# Altium schematic sheet STM32F4 - AMS.SchDoc
size A4
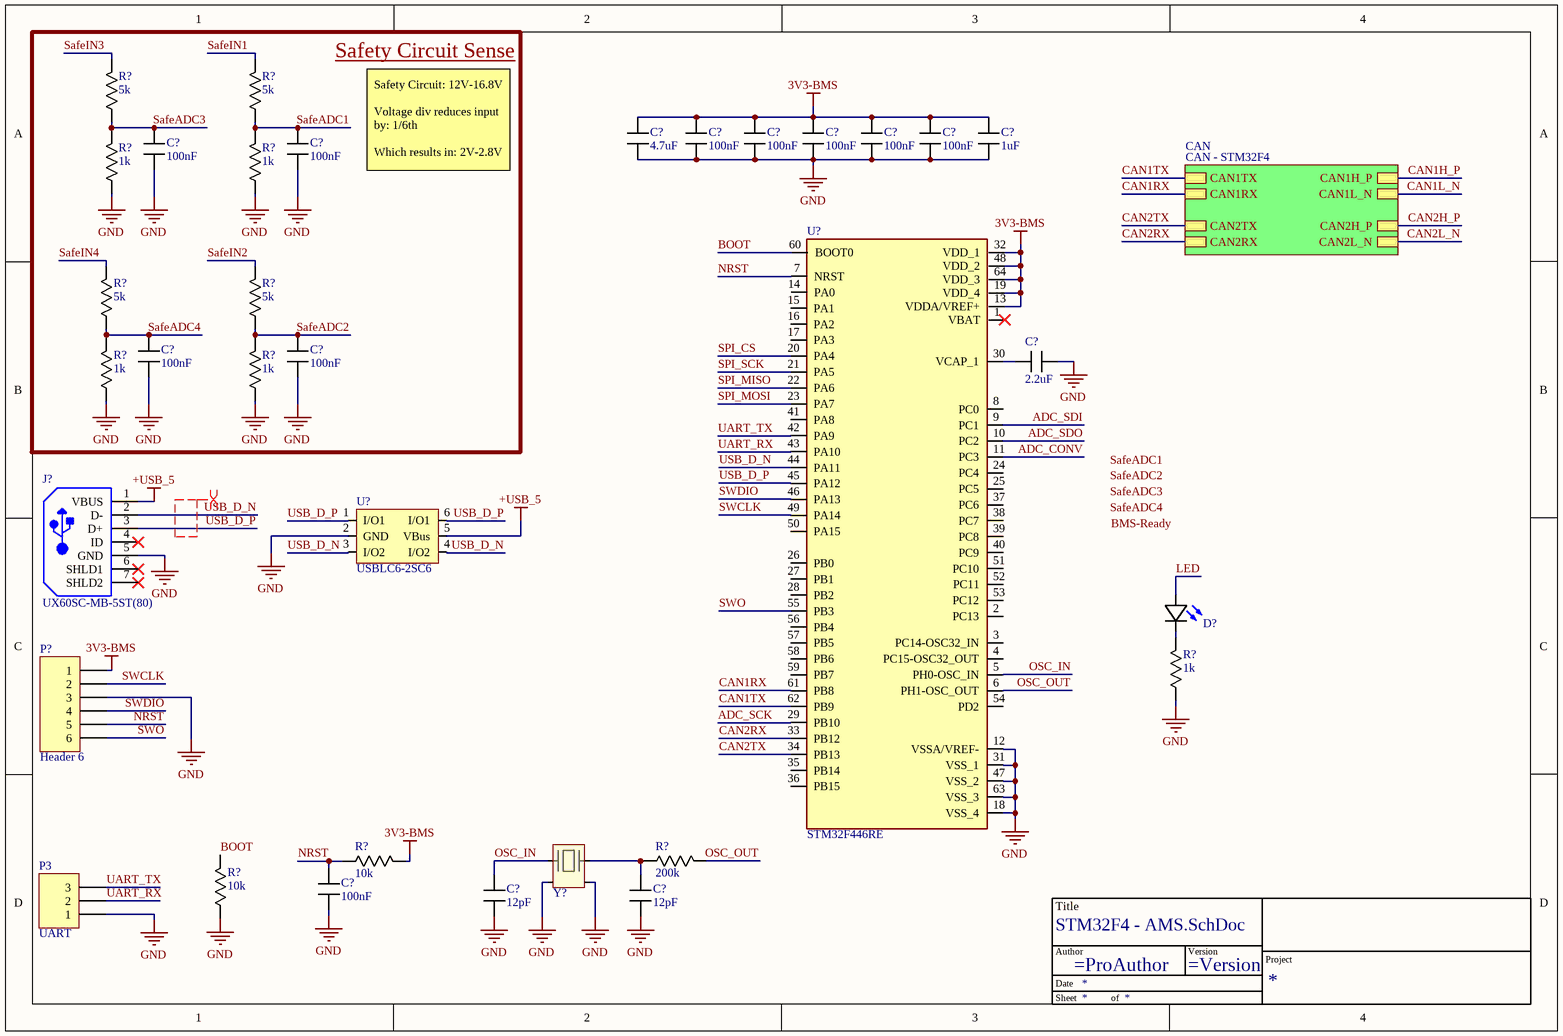
[diagram p0: STM32F4 - AMS.SchDoc]

## Parts
(Parts that share a designator on the sheet are numbered #1, #2 ... from top to bottom, then left to right.)
*  TitleBlock  (value not drawn)  (graphical)
C?#1  value 4.7uF  [C_0603]  (hidden comment: C)
C?#2  value 100nF  [C_0603]  (hidden comment: C)
C?#3  value 100nF  [C_0603]  (hidden comment: C)
C?#4  value 100nF  [C_0603]  (hidden comment: C)
C?#5  value 100nF  [C_0603]  (hidden comment: C)
C?#6  value 100nF  [C_0603]  (hidden comment: C)
C?#7  value 1uF  [C_0603]  (hidden comment: C)
C?#8  value 100nF  [C_0603]  (hidden comment: CL10B104KA8NNWC)
C?#9  value 100nF  [C_0603]  (hidden comment: CL10B104KA8NNWC)
C?#10  value 100nF  [C_0603]  (hidden comment: CL10B104KA8NNWC)
C?#11  value 100nF  [C_0603]  (hidden comment: CL10B104KA8NNWC)
C?#12  value 2.2uF  [C_0603]  (hidden comment: C)
C?#13  value 100nF  [C_0603]  (hidden comment: C)
C?#14  value 12pF  [0402]  (hidden comment: C)
C?#15  value 12pF  [0402]  (hidden comment: C)
D?  150060BS55040  [LED (0603)]  (value not drawn)
J?  UX60SC-MB-5ST(80)  [HIRO-UX60SC-MB-5ST(80)_V]
P3  UART  [HDR1X3]
P?  Header 6  [HDR1X6]
R?#1  value 5k  [R-0603]  (hidden comment: CR0603AFX-5101EAS)
R?#2  value 5k  [R-0603]  (hidden comment: CR0603AFX-5101EAS)
R?#3  value 1k  [R-0603]  (hidden comment: SFR03EZPF1001)
R?#4  value 1k  [R-0603]  (hidden comment: SFR03EZPF1001)
R?#5  value 5k  [R-0603]  (hidden comment: CR0603AFX-5101EAS)
R?#6  value 5k  [R-0603]  (hidden comment: CR0603AFX-5101EAS)
R?#7  value 1k  [R-0603]  (hidden comment: SFR03EZPF1001)
R?#8  value 1k  [R-0603]  (hidden comment: SFR03EZPF1001)
R?#9  value 1k  [R-0603]  (hidden comment: Resistor)
R?#10  value 10k  [R-0603]  (hidden comment: Resistor)
R?#11  value 200k  [0402]  (hidden comment: Resistor)
R?#12  value 10k  [R-0603]  (hidden comment: Resistor)
U?#1  USBLC6-2SC6  [USBLC6-2SC6]
U?#2  STM32F446RE  [QFP50P1200X1200X160-64N]
Y?  CX2016DB26000D0FLJCC  (value not drawn)

## Blocks framed on the sheet
Safety Circuit Sense: C?#8-C?#11 R?#1-R?#8

## Sub-sheets
CAN = CAN - STM32F4: CAN2H_P, CAN2RX, CAN1TX, CAN1H_P, CAN1L_N, CAN1RX, CAN2TX, CAN2L_N

## Nets
3V3-BMS: C?#1.2 C?#2.2 C?#3.2 C?#4.2 C?#5.2 C?#6.2 C?#7.2 P?.1 R?#10.2 U?#2.13(VDDA/VREF+) U?#2.19(VDD_4) U?#2.32(VDD_1) U?#2.48(VDD_2) U?#2.64(VDD_3)
+USB_5: J?.1(VBUS) U?#1.5(VBus)
GND: C?#1.1 C?#2.1 C?#3.1 C?#4.1 C?#5.1 C?#6.1 C?#7.1 C?#8.1 C?#9.1 C?#10.1 C?#11.1 C?#12.1 C?#13.1 C?#14.1 C?#15.1 J?.5(GND) P3.1 P?.3 R?#3.1 R?#4.1 R?#7.1 R?#8.1 R?#9.1 R?#12.1 U?#1.2(GND) U?#2.12(VSSA/VREF-) U?#2.18(VSS_4) U?#2.31(VSS_1) U?#2.47(VSS_2) U?#2.63(VSS_3) Y?.2(GND) Y?.4(GND)
ADC_CONV: U?#2.11(PC3)
ADC_SCK: U?#2.29(PB10)
ADC_SDI: U?#2.9(PC1)
ADC_SDO: U?#2.10(PC2)
BOOT: R?#12.2 U?#2.60(BOOT0)
CAN1H_P: sheet CAN/CAN1H_P
CAN1L_N: sheet CAN/CAN1L_N
CAN1RX: U?#2.61(PB8) ; sheet CAN/CAN1RX
CAN1TX: U?#2.62(PB9) ; sheet CAN/CAN1TX
CAN2H_P: sheet CAN/CAN2H_P
CAN2L_N: sheet CAN/CAN2L_N
CAN2RX: U?#2.33(PB12) ; sheet CAN/CAN2RX
CAN2TX: U?#2.34(PB13) ; sheet CAN/CAN2TX
LED: D?.2(A)
NRST: C?#13.2 P?.5 R?#10.1 U?#2.7(NRST)
OSC_IN: C?#14.2 U?#2.5(PH0-OSC_IN) Y?.1
OSC_OUT: R?#11.2 U?#2.6(PH1-OSC_OUT)
SafeADC1: C?#9.2 R?#2.1 R?#4.2
SafeADC2: C?#11.2 R?#6.1 R?#8.2
SafeADC3: C?#8.2 R?#1.1 R?#3.2
SafeADC4: C?#10.2 R?#5.1 R?#7.2
SafeIN1: R?#2.2
SafeIN2: R?#6.2
SafeIN3: R?#1.2
SafeIN4: R?#5.2
SPI_CS: U?#2.20(PA4)
SPI_MISO: U?#2.22(PA6)
SPI_MOSI: U?#2.23(PA7)
SPI_SCK: U?#2.21(PA5)
SWCLK: P?.2 U?#2.49(PA14)
SWDIO: P?.4 U?#2.46(PA13)
SWO: P?.6 U?#2.55(PB3)
UART_RX: P3.2 U?#2.43(PA10)
UART_TX: P3.3 U?#2.42(PA9)
USB_D_N: J?.2(D-) U?#1.3(I/O2) U?#1.4(I/O2) U?#2.44(PA11)
USB_D_P: J?.3(D+) U?#1.1(I/O1) U?#1.6(I/O1) U?#2.45(PA12)
NetC?#12_2: C?#12.2 U?#2.30(VCAP_1)
NetC?#15_2: C?#15.2 R?#11.1 Y?.3
NetD?_1: D?.1(K) R?#9.2

Not connected (* = marked no-connect by the designer): J? 4(ID)* 6(SHLD1)* 7(SHLD2)*; U?#2 1(VBAT)* 2(PC13) 3(PC14-OSC32_IN) 4(PC15-OSC32_OUT) 8(PC0) 14(PA0) 15(PA1) 16(PA2) 17(PA3) 24(PC4) 25(PC5) 26(PB0) 27(PB1) 28(PB2) 35(PB14) 36(PB15) 37(PC6) 38(PC7) 39(PC8) 40(PC9) 41(PA8) 50(PA15) 51(PC10) 52(PC11) 53(PC12) 54(PD2) 56(PB4) 57(PB5) 58(PB6) 59(PB7)

## Layout directives
differential pair; rule Differential Pairs Routing [Pref Gap = 10mil    Min Gap  = 10mil    Max Gap  = 10milPref Width = 15mil    Min Width  = 15mil    Max Width  = 15mil]; net class USB_Diff: (no net found under the mark)

## Notes on the sheet
- Safety Circuit: 12V-16.8V
  Voltage div reduces input by: 1/6th
  Which results in: 2V-2.8V
- Labels drawn without touching a wire or pin: BMS-Ready, SafeADC1, SafeADC2, SafeADC3, SafeADC4
- (in symbol TitleBlock) Title; Author; Version; Project; Date; Sheet; of

## Library data of the parts
C?#1-C?#15 = Capacitor: ComponentLink1Description: New link; ComponentLink1URL: *
D? = 150060BS55040: LED BLUE DIFFUSED 0603 SMD; Manufacturer: Wurth Electronics; Lens Style: Flat; Luminous Intensity: 80mcd; Forward Voltage: 3.2V; Test Current: 20mA; Viewing Angle: 140°; Dominant Wavelength: 470nm; Lens Size: 0.8mm; Supplier 1: Mouser; Manufacturer Part Number: 150060BS55040; RoHS: No; Pricing 1: 1=0.18000, 10=0.16800, 50=0.16800, 100=0.15200, 1000=0.12100, 10000=0.10600 (USD); Mount: Surface Mount; Case/Package: 0603; Color: Blue; Packaging: Tape and Reel; Lens Transparency: Diffused; Length: 1.6mm; Width: 0.8mm; Height: 0.5mm; RoHS Compliant: No; ComponentLink1URL: http://www.farnell.com/datasheets/2621640.pdf?src-supplier=Farnell; ComponentLink1Description: http://www.farnell.com/datasheets/2621640.pdf?src-supplier=Farnell; ComponentLink2URL: https://www.we-online.de/web/en/index.php/download/media/07_electronic_components/download_center_1/application_notes_berichte/ano002_leds___the_future_of_horticultural_lighting/ANO002b_EN_LEDs_The_Future_of_Horticultural_Lighting.pdf?src-supplier=Digi-Key; ComponentLink2Description: https://www.we-online.de/web/en/index.php/download/media/07_electronic_components/download_center_1/application_notes_berichte/ano002_leds___the_future_of_horticultural_lighting/ANO002b_EN_LEDs_The_Future_of_Horticultural_Lighting.pdf?src-supplier=Digi-Key; ComponentLink3URL: https://katalog.we-online.de/pbs/datasheet/150060BS55040.pdf?src-supplier=Digi-Key; ComponentLink3Description: https://katalog.we-online.de/pbs/datasheet/150060BS55040.pdf?src-supplier=Digi-Key; ComponentLink4URL: http://www.farnell.com/datasheets/2621640.pdf?src-supplier=Newark; ComponentLink4Description: http://www.farnell.com/datasheets/2621640.pdf?src-supplier=Newark; Supplier Part Number 1: 710-150060BS55040
J? = CMP-2000-07376-1: Mini-B Connector, SMT Mount Receptacle Meeting Requirement of USB 2.0 Standard, 5 V, 1 A, -30 to 75 degC, 5-Pin SMD, RoHS, Tape and Reel; Manufacturer: Hirose Electric; Product Length (mm): 7.7mm; Voltage Rating Max: 5VAC; Number of Contacts: 5POS; Number of Ports: 1Port; Product Height (mm): 3.95mm; Product Depth (mm): 7mm; Pitch (mm): 0.8mm; Gender: RCP; Current Rating (Max): 1A; DELETED: Compliant; Product Diameter (mm): NotRequiredmm; Body Orientation: RightAngle; Operating Temp Range: -30Cto75C; Packaging: TapeandReel; Termination Method: Solder; Number of Terminals: 5; Package Description: 5-Pin Surface Mount Device, Body 7.7 x 7 mm, Pitch 0.8 mm; Mounting Technology: SurfaceMount; Contact Material: CopperAlloy; Package Reference: UX60SC-MB-5ST(80); Operating Temperature Min Deg. C: -30C; Housing Material: Synthetic; Operating Temperature Max Deg. C: 75C; Manufacturer URL: https://www.hirose.com; Datasheet Version: 04/2008; Type: Mini-USB; Datasheet URL: https://datasheet.ciiva.com/4598/e24000153-34949-4598883.pdf; Contact Plating: Gold; Mounting Style: ThroughHole
P3 = Header 3: Header, 3-Pin; Manufacturer: -; Mfg No.: -; Notes: -; Suppl. Link/No.: -; Supplier: Digikey; Value: -
P? = Header 6: Header, 6-Pin; LatestRevisionDate: 17-Jul-2002; LatestRevisionNote: Re-released for DXP Platform.; Publisher: Altium Limited
R?#1-R?#8 = Resistor: Voltage divider
U?#1 = USBLC6-2SC6: TVS DIODE 5.25V 17V SOT23-6; Manufacturer: STMicroelectronics; Direction: Unidirectional,Bidirectional; Capacitance: 3.5pF; Operating Supply Voltage: 1.1V; Number of Channels: 2; Breakdown Voltage: 6V; Power Line Protection: Yes; Test Current: 1mA; Max Reverse Leakage Current: 150nA; Peak Pulse Current: 5A; Element Configuration: Dual; Data Rate: 480Mbps; Number of Elements: 1; Working Voltage: 5V; Supplier 1: RSComponents; Manufacturer Part Number: USBLC6-2SC6; RoHS: Yes; Category: TVS Diodes; Stock 1: 1; Pricing 1: 10=0.61400, 50=0.57700, 100=0.54700, 250=0.51600, 500=0.49000 (USD); Mount: Surface Mount; Case/Package: SOT-23; Number of Pins: 6; Contact Plating: Tin,Matte; Min Operating Temperature: -40°C; Max Operating Temperature: 125°C; Clamping Voltage: 17V; Packaging: Tape and Reel; Package Quantity: 3000; Termination: SMD/SMT; Number of Bidirectional Channels: 2; Reverse Standoff Voltage: 5.25V; Min Breakdown Voltage: 6V; ESD Protection: Yes; Leakage Current: 150nA; Series: USB; Reverse Breakdown Voltage: 6V; Polarity: Unidirectional,Bidirectional; Max Breakdown Voltage: 6V; Clamping Voltage-Max: 17V; Length: 3.05mm; Width: 1.75mm; Height: 1.3mm; Depth: 1.75mm; Radiation Hardening: No; REACH SVHC: No SVHC; Lead Free: Lead Free; RoHS Compliant: Yes; ComponentLink1URL: https://datasheet.ciiva.com/1268/1690354-1268384.pdf?src-supplier=Element14; ComponentLink1Description: https://datasheet.ciiva.com/1268/1690354-1268384.pdf?src-supplier=Element14; ComponentLink2URL: https://datasheet.ciiva.com/4508/cd00050750-113117-4508433.pdf?src-supplier=Mouser; ComponentLink2Description: https://datasheet.ciiva.com/4508/cd00050750-113117-4508433.pdf?src-supplier=Mouser; ComponentLink3URL: https://datasheet.ciiva.com/15143/getdatasheetpartid-148465-15143789.pdf?src-supplier=Verical; ComponentLink3Description: https://datasheet.ciiva.com/15143/getdatasheetpartid-148465-15143789.pdf?src-supplier=Verical; ComponentLink4URL: https://datasheet.ciiva.com/26787/usblc6-2sc6-26787908.pdf?src-supplier=IIIC; ComponentLink4Description: https://datasheet.ciiva.com/26787/usblc6-2sc6-26787908.pdf?src-supplier=IIIC; ComponentLink5URL: https://datasheet.ciiva.com/16200/cd00050750-16200026.pdf?src-supplier=Future+Electronics; ComponentLink5Description: https://datasheet.ciiva.com/16200/cd00050750-16200026.pdf?src-supplier=Future+Electronics; ComponentLink6URL: https://datasheet.ciiva.com/41444/001184109-da-01-en-ic-esd-protecti-usblc6-2sc6-sot-23-6-stm-41444156.pdf?src-supplier=Conrad; ComponentLink6Description: https://datasheet.ciiva.com/41444/001184109-da-01-en-ic-esd-protecti-usblc6-2sc6-sot-23-6-stm-41444156.pdf?src-supplier=Conrad; Supplier Part Number 1: 6247693
U?#2 = STM32F446RE: 32 Bit Microcontroller, High Performance, ARM Cortex-M4, 180 MHz, 256 KB, 128 KB, 64, LQFP; MP: STM32F446RE; Value: *
Y? = CX2016DB26000D0FLJCC: Crystals AEC-Q200 26000kHz 8pF 2x1.6mm